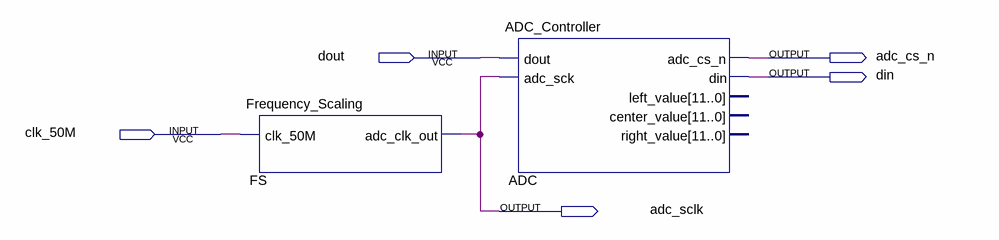
[diagram p0: schematic sheet]
// Quartus schematic AB_LFA_test.bdf as structural Verilog: 2 symbols, 5 pins
module AB_LFA_test (
  input  dout,
  input  clk_50M,
  output adc_cs_n,
  output din,
  output adc_sclk
);

  Frequency_Scaling FS (.clk_50M(clk_50M), .adc_clk_out(adc_sclk));
  ADC_Controller ADC (
    .dout(dout), .adc_sck(adc_sclk), .adc_cs_n(adc_cs_n), .din(din));  // open: left_value, center_value, right_value
endmodule
